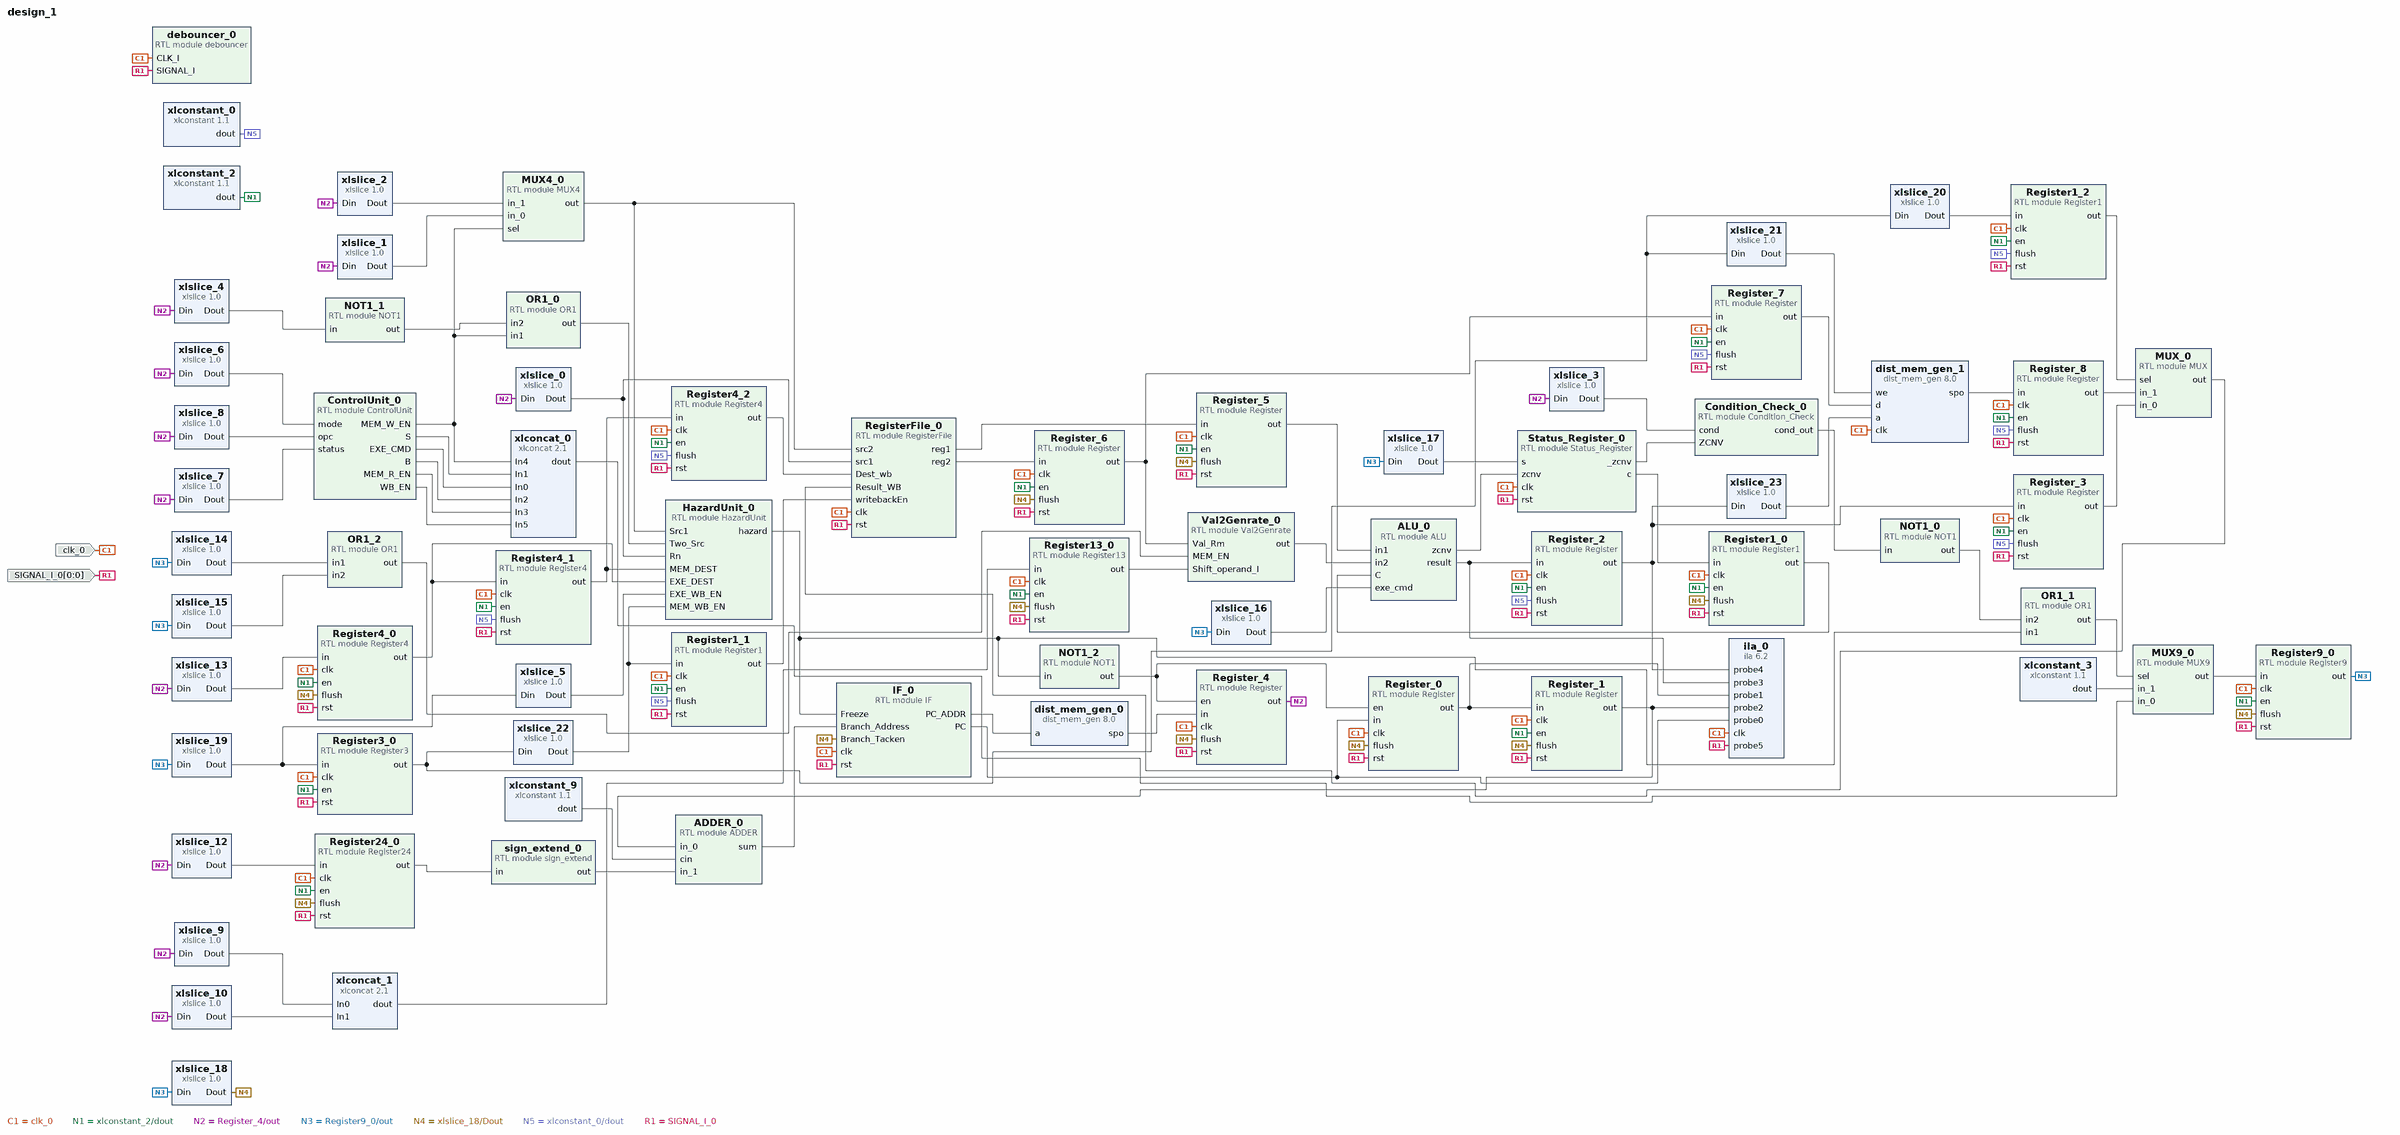
[diagram p0: block diagram of the top level]
# Vivado block design design_1, xc7z010clg400-1, Vivado 2018.3
create_bd_design design_1

create_bd_port -dir I -type clk clk_0
create_bd_port -dir I -from 0 -to 0 SIGNAL_I_0

create_bd_cell -type ip -vlnv xilinx.com:ip:xlconstant:1.1 xlconstant_2
create_bd_cell -type ip -vlnv xilinx.com:ip:ila:6.2 ila_0
set_property -dict [list \
  CONFIG.C_ENABLE_ILA_AXI_MON false \
  CONFIG.C_MONITOR_TYPE Native \
  CONFIG.C_NUM_OF_PROBES 6 \
  CONFIG.C_PROBE0_TYPE 1 \
  CONFIG.C_PROBE0_WIDTH 32 \
  CONFIG.C_PROBE1_TYPE 1 \
  CONFIG.C_PROBE1_WIDTH 32 \
  CONFIG.C_PROBE2_TYPE 1 \
  CONFIG.C_PROBE2_WIDTH 32 \
  CONFIG.C_PROBE3_TYPE 1 \
  CONFIG.C_PROBE3_WIDTH 32 \
  CONFIG.C_PROBE4_TYPE 1 \
  CONFIG.C_PROBE4_WIDTH 32 \
  CONFIG.C_PROBE5_TYPE 2 \
  CONFIG.C_PROBE6_TYPE 1 \
  CONFIG.C_PROBE6_WIDTH 1 \
] [get_bd_cells ila_0]
create_bd_cell -type module -reference ControlUnit ControlUnit_0
create_bd_cell -type module -reference RegisterFile RegisterFile_0
create_bd_cell -type ip -vlnv xilinx.com:ip:xlslice:1.0 xlslice_0
set_property -dict {CONFIG.DIN_FROM 19 CONFIG.DIN_TO 16 CONFIG.DOUT_WIDTH 4} [get_bd_cells xlslice_0]
create_bd_cell -type ip -vlnv xilinx.com:ip:xlslice:1.0 xlslice_1
set_property -dict {CONFIG.DIN_FROM 3 CONFIG.DIN_TO 0 CONFIG.DOUT_WIDTH 4} [get_bd_cells xlslice_1]
create_bd_cell -type ip -vlnv xilinx.com:ip:xlslice:1.0 xlslice_2
set_property -dict {CONFIG.DIN_FROM 15 CONFIG.DIN_TO 12 CONFIG.DOUT_WIDTH 4} [get_bd_cells xlslice_2]
create_bd_cell -type module -reference MUX4 MUX4_0
create_bd_cell -type module -reference OR1 OR1_0
create_bd_cell -type ip -vlnv xilinx.com:ip:xlslice:1.0 xlslice_3
set_property -dict {CONFIG.DIN_FROM 31 CONFIG.DIN_TO 28 CONFIG.DOUT_WIDTH 4} [get_bd_cells xlslice_3]
create_bd_cell -type ip -vlnv xilinx.com:ip:xlslice:1.0 xlslice_4
set_property -dict {CONFIG.DIN_FROM 25 CONFIG.DIN_TO 25 CONFIG.DOUT_WIDTH 1} [get_bd_cells xlslice_4]
create_bd_cell -type module -reference MUX9 MUX9_0
create_bd_cell -type ip -vlnv xilinx.com:ip:xlconcat:2.1 xlconcat_0
set_property -dict [list \
  CONFIG.IN0_WIDTH 4 \
  CONFIG.IN1_WIDTH 1 \
  CONFIG.IN2_WIDTH 1 \
  CONFIG.IN3_WIDTH 1 \
  CONFIG.IN4_WIDTH 1 \
  CONFIG.IN5_WIDTH 1 \
  CONFIG.NUM_PORTS 6 \
] [get_bd_cells xlconcat_0]
create_bd_cell -type ip -vlnv xilinx.com:ip:xlconstant:1.1 xlconstant_3
set_property -dict {CONFIG.CONST_VAL 0 CONFIG.CONST_WIDTH 9} [get_bd_cells xlconstant_3]
create_bd_cell -type module -reference OR1 OR1_1
create_bd_cell -type module -reference NOT1 NOT1_0
create_bd_cell -type module -reference NOT1 NOT1_1
create_bd_cell -type ip -vlnv xilinx.com:ip:xlslice:1.0 xlslice_6
set_property -dict {CONFIG.DIN_FROM 27 CONFIG.DIN_TO 26 CONFIG.DOUT_WIDTH 2} [get_bd_cells xlslice_6]
create_bd_cell -type ip -vlnv xilinx.com:ip:xlslice:1.0 xlslice_7
set_property -dict {CONFIG.DIN_FROM 20 CONFIG.DIN_TO 20 CONFIG.DOUT_WIDTH 1} [get_bd_cells xlslice_7]
create_bd_cell -type ip -vlnv xilinx.com:ip:xlslice:1.0 xlslice_8
set_property -dict {CONFIG.DIN_FROM 24 CONFIG.DIN_TO 21 CONFIG.DOUT_WIDTH 4} [get_bd_cells xlslice_8]
create_bd_cell -type module -reference Condition_Check Condition_Check_0
create_bd_cell -type ip -vlnv xilinx.com:ip:dist_mem_gen:8.0 dist_mem_gen_0
set_property -dict [list \
  CONFIG.coefficient_file ../../../../../../../output_ultimate.coe \
  CONFIG.data_width 32 \
  CONFIG.depth 8192 \
  CONFIG.memory_type rom \
] [get_bd_cells dist_mem_gen_0]
create_bd_cell -type ip -vlnv xilinx.com:ip:xlconcat:2.1 xlconcat_1
set_property -dict {CONFIG.IN0_WIDTH 1 CONFIG.IN1_WIDTH 12} [get_bd_cells xlconcat_1]
create_bd_cell -type ip -vlnv xilinx.com:ip:xlslice:1.0 xlslice_9
set_property -dict {CONFIG.DIN_FROM 25 CONFIG.DIN_TO 25 CONFIG.DOUT_WIDTH 1} [get_bd_cells xlslice_9]
create_bd_cell -type ip -vlnv xilinx.com:ip:xlslice:1.0 xlslice_10
set_property -dict {CONFIG.DIN_FROM 11 CONFIG.DOUT_WIDTH 12} [get_bd_cells xlslice_10]
create_bd_cell -type ip -vlnv xilinx.com:ip:xlslice:1.0 xlslice_12
set_property -dict {CONFIG.DIN_FROM 23 CONFIG.DOUT_WIDTH 24} [get_bd_cells xlslice_12]
create_bd_cell -type ip -vlnv xilinx.com:ip:xlslice:1.0 xlslice_13
set_property -dict {CONFIG.DIN_FROM 15 CONFIG.DIN_TO 12 CONFIG.DOUT_WIDTH 4} [get_bd_cells xlslice_13]
create_bd_cell -type module -reference OR1 OR1_2
create_bd_cell -type ip -vlnv xilinx.com:ip:xlslice:1.0 xlslice_14
set_property -dict {CONFIG.DIN_FROM 6 CONFIG.DIN_TO 6 CONFIG.DIN_WIDTH 9 CONFIG.DOUT_WIDTH 1} [get_bd_cells xlslice_14]
create_bd_cell -type ip -vlnv xilinx.com:ip:xlslice:1.0 xlslice_15
set_property -dict {CONFIG.DIN_FROM 7 CONFIG.DIN_TO 7 CONFIG.DIN_WIDTH 9 CONFIG.DOUT_WIDTH 1} [get_bd_cells xlslice_15]
create_bd_cell -type module -reference Val2Genrate Val2Genrate_0
create_bd_cell -type ip -vlnv xilinx.com:ip:xlslice:1.0 xlslice_16
set_property -dict {CONFIG.DIN_FROM 3 CONFIG.DIN_TO 0 CONFIG.DIN_WIDTH 9 CONFIG.DOUT_WIDTH 4} [get_bd_cells xlslice_16]
create_bd_cell -type module -reference ADDER ADDER_0
create_bd_cell -type ip -vlnv xilinx.com:ip:xlconstant:1.1 xlconstant_9
set_property -dict {CONFIG.CONST_VAL 0} [get_bd_cells xlconstant_9]
create_bd_cell -type ip -vlnv xilinx.com:ip:xlslice:1.0 xlslice_17
set_property -dict {CONFIG.DIN_FROM 4 CONFIG.DIN_TO 4 CONFIG.DIN_WIDTH 9 CONFIG.DOUT_WIDTH 1} [get_bd_cells xlslice_17]
create_bd_cell -type module -reference Status_Register Status_Register_0
create_bd_cell -type ip -vlnv xilinx.com:ip:xlslice:1.0 xlslice_18
set_property -dict {CONFIG.DIN_FROM 5 CONFIG.DIN_TO 5 CONFIG.DIN_WIDTH 9 CONFIG.DOUT_WIDTH 1} [get_bd_cells xlslice_18]
create_bd_cell -type ip -vlnv xilinx.com:ip:xlslice:1.0 xlslice_19
set_property -dict {CONFIG.DIN_FROM 8 CONFIG.DIN_TO 6 CONFIG.DIN_WIDTH 9 CONFIG.DOUT_WIDTH 3} [get_bd_cells xlslice_19]
create_bd_cell -type module -reference Register Register_0
create_bd_cell -type module -reference Register Register_4
create_bd_cell -type module -reference Register13 Register13_0
create_bd_cell -type module -reference Register1 Register1_0
create_bd_cell -type module -reference Register24 Register24_0
create_bd_cell -type module -reference Register4 Register4_0
create_bd_cell -type module -reference Register9 Register9_0
create_bd_cell -type module -reference Register Register_1
create_bd_cell -type module -reference Register4 Register4_1
create_bd_cell -type module -reference Register Register_2
create_bd_cell -type ip -vlnv xilinx.com:ip:xlconstant:1.1 xlconstant_0
set_property -dict {CONFIG.CONST_VAL 0} [get_bd_cells xlconstant_0]
create_bd_cell -type module -reference Register3 Register3_0
create_bd_cell -type module -reference Register Register_5
create_bd_cell -type module -reference Register Register_6
create_bd_cell -type module -reference Register Register_7
create_bd_cell -type module -reference debouncer debouncer_0
create_bd_cell -type ip -vlnv xilinx.com:ip:dist_mem_gen:8.0 dist_mem_gen_1
set_property -dict {CONFIG.data_width 32 CONFIG.depth 1024} [get_bd_cells dist_mem_gen_1]
create_bd_cell -type ip -vlnv xilinx.com:ip:xlslice:1.0 xlslice_20
set_property -dict {CONFIG.DIN_FROM 0 CONFIG.DIN_TO 0 CONFIG.DIN_WIDTH 3} [get_bd_cells xlslice_20]
create_bd_cell -type ip -vlnv xilinx.com:ip:xlslice:1.0 xlslice_21
set_property -dict {CONFIG.DIN_FROM 1 CONFIG.DIN_TO 1 CONFIG.DIN_WIDTH 3 CONFIG.DOUT_WIDTH 1} [get_bd_cells xlslice_21]
create_bd_cell -type ip -vlnv xilinx.com:ip:xlslice:1.0 xlslice_22
set_property -dict {CONFIG.DIN_FROM 2 CONFIG.DIN_TO 2 CONFIG.DIN_WIDTH 3 CONFIG.DOUT_WIDTH 1} [get_bd_cells xlslice_22]
create_bd_cell -type module -reference Register1 Register1_2
create_bd_cell -type module -reference Register4 Register4_2
create_bd_cell -type module -reference Register Register_8
create_bd_cell -type module -reference Register1 Register1_1
create_bd_cell -type module -reference Register Register_3
create_bd_cell -type module -reference MUX MUX_0
create_bd_cell -type module -reference HazardUnit HazardUnit_0
create_bd_cell -type ip -vlnv xilinx.com:ip:xlslice:1.0 xlslice_23
set_property -dict {CONFIG.DIN_FROM 9 CONFIG.DOUT_WIDTH 10} [get_bd_cells xlslice_23]
create_bd_cell -type ip -vlnv xilinx.com:ip:xlslice:1.0 xlslice_5
set_property -dict {CONFIG.DIN_FROM 2 CONFIG.DIN_TO 2 CONFIG.DIN_WIDTH 3} [get_bd_cells xlslice_5]
create_bd_cell -type module -reference IF IF_0
create_bd_cell -type module -reference NOT1 NOT1_2
create_bd_cell -type module -reference ALU ALU_0
create_bd_cell -type module -reference sign_extend sign_extend_0

# ---- connections ----

connect_bd_net -net clk_0_1 [get_bd_ports clk_0] \
  [get_bd_pins ila_0/clk] [get_bd_pins RegisterFile_0/clk] [get_bd_pins Status_Register_0/clk] [get_bd_pins Register_0/clk] \
  [get_bd_pins Register_4/clk] [get_bd_pins Register13_0/clk] [get_bd_pins Register1_0/clk] [get_bd_pins Register24_0/clk] \
  [get_bd_pins Register4_0/clk] [get_bd_pins Register9_0/clk] [get_bd_pins Register_1/clk] [get_bd_pins Register4_1/clk] \
  [get_bd_pins Register_2/clk] [get_bd_pins Register3_0/clk] [get_bd_pins Register_5/clk] [get_bd_pins Register_6/clk] \
  [get_bd_pins Register_7/clk] [get_bd_pins Register4_2/clk] [get_bd_pins Register1_2/clk] [get_bd_pins Register_8/clk] \
  [get_bd_pins dist_mem_gen_1/clk] [get_bd_pins Register1_1/clk] [get_bd_pins Register_3/clk] [get_bd_pins debouncer_0/CLK_I] \
  [get_bd_pins IF_0/clk]
connect_bd_net [get_bd_pins IF_0/PC_ADDR] [get_bd_pins dist_mem_gen_0/a]
connect_bd_net [get_bd_pins IF_0/PC] [get_bd_pins ila_0/probe0] [get_bd_pins Register_0/in]
connect_bd_net [get_bd_pins Register_0/out] [get_bd_pins ila_0/probe1] [get_bd_pins Register_1/in]
connect_bd_net [get_bd_pins Register_1/out] [get_bd_pins ila_0/probe2] [get_bd_pins ADDER_0/in_0]
connect_bd_net [get_bd_pins xlconstant_2/dout] \
  [get_bd_pins Register13_0/en] [get_bd_pins Register1_0/en] [get_bd_pins Register24_0/en] [get_bd_pins Register4_0/en] \
  [get_bd_pins Register9_0/en] [get_bd_pins Register_1/en] [get_bd_pins Register4_1/en] [get_bd_pins Register_2/en] \
  [get_bd_pins Register3_0/en] [get_bd_pins Register_5/en] [get_bd_pins Register_6/en] [get_bd_pins Register_7/en] \
  [get_bd_pins Register1_2/en] [get_bd_pins Register4_2/en] [get_bd_pins Register_8/en] [get_bd_pins Register1_1/en] \
  [get_bd_pins Register_3/en]
connect_bd_net [get_bd_pins xlslice_2/Dout] [get_bd_pins MUX4_0/in_1]
connect_bd_net [get_bd_pins xlslice_1/Dout] [get_bd_pins MUX4_0/in_0]
connect_bd_net [get_bd_pins xlslice_0/Dout] [get_bd_pins RegisterFile_0/src1] [get_bd_pins HazardUnit_0/Rn]
connect_bd_net [get_bd_pins MUX4_0/out] [get_bd_pins RegisterFile_0/src2] [get_bd_pins HazardUnit_0/Src1]
connect_bd_net [get_bd_pins RegisterFile_0/reg1] [get_bd_pins Register_5/in]
connect_bd_net [get_bd_pins RegisterFile_0/reg2] [get_bd_pins Register_6/in]
connect_bd_net [get_bd_pins Register_4/out] \
  [get_bd_pins xlslice_0/Din] [get_bd_pins xlslice_1/Din] [get_bd_pins xlslice_2/Din] [get_bd_pins xlslice_4/Din] \
  [get_bd_pins xlslice_3/Din] [get_bd_pins xlslice_6/Din] [get_bd_pins xlslice_8/Din] [get_bd_pins xlslice_7/Din] \
  [get_bd_pins xlslice_9/Din] [get_bd_pins xlslice_10/Din] [get_bd_pins xlslice_12/Din] [get_bd_pins xlslice_13/Din]
connect_bd_net [get_bd_pins ControlUnit_0/S] [get_bd_pins xlconcat_0/In1]
connect_bd_net [get_bd_pins ControlUnit_0/EXE_CMD] [get_bd_pins xlconcat_0/In0]
connect_bd_net [get_bd_pins ControlUnit_0/B] [get_bd_pins xlconcat_0/In2]
connect_bd_net [get_bd_pins ControlUnit_0/MEM_R_EN] [get_bd_pins xlconcat_0/In3]
connect_bd_net [get_bd_pins ControlUnit_0/MEM_W_EN] [get_bd_pins xlconcat_0/In4] [get_bd_pins MUX4_0/sel] [get_bd_pins OR1_0/in1]
connect_bd_net [get_bd_pins ControlUnit_0/WB_EN] [get_bd_pins xlconcat_0/In5]
connect_bd_net [get_bd_pins xlconcat_0/dout] [get_bd_pins MUX9_0/in_0]
connect_bd_net [get_bd_pins xlconstant_3/dout] [get_bd_pins MUX9_0/in_1]
connect_bd_net [get_bd_pins OR1_1/out] [get_bd_pins MUX9_0/sel]
connect_bd_net [get_bd_pins NOT1_0/out] [get_bd_pins OR1_1/in2]
connect_bd_net [get_bd_pins MUX9_0/out] [get_bd_pins Register9_0/in]
connect_bd_net [get_bd_pins xlslice_4/Dout] [get_bd_pins NOT1_1/in]
connect_bd_net [get_bd_pins NOT1_1/out] [get_bd_pins OR1_0/in2]
connect_bd_net [get_bd_pins xlslice_6/Dout] [get_bd_pins ControlUnit_0/mode]
connect_bd_net [get_bd_pins xlslice_8/Dout] [get_bd_pins ControlUnit_0/opc]
connect_bd_net [get_bd_pins xlslice_7/Dout] [get_bd_pins ControlUnit_0/status]
connect_bd_net [get_bd_pins xlslice_3/Dout] [get_bd_pins Condition_Check_0/cond]
connect_bd_net [get_bd_pins Condition_Check_0/cond_out] [get_bd_pins NOT1_0/in]
connect_bd_net [get_bd_pins dist_mem_gen_0/spo] [get_bd_pins Register_4/in]
connect_bd_net [get_bd_pins xlconcat_1/dout] [get_bd_pins Register13_0/in]
connect_bd_net [get_bd_pins xlslice_9/Dout] [get_bd_pins xlconcat_1/In0]
connect_bd_net [get_bd_pins xlslice_10/Dout] [get_bd_pins xlconcat_1/In1]
connect_bd_net [get_bd_pins xlslice_12/Dout] [get_bd_pins Register24_0/in]
connect_bd_net [get_bd_pins xlslice_13/Dout] [get_bd_pins Register4_0/in]
connect_bd_net [get_bd_pins Register9_0/out] \
  [get_bd_pins xlslice_14/Din] [get_bd_pins xlslice_15/Din] [get_bd_pins xlslice_16/Din] [get_bd_pins xlslice_17/Din] \
  [get_bd_pins xlslice_18/Din] [get_bd_pins xlslice_19/Din]
connect_bd_net [get_bd_pins xlslice_14/Dout] [get_bd_pins OR1_2/in1]
connect_bd_net [get_bd_pins xlslice_15/Dout] [get_bd_pins OR1_2/in2]
connect_bd_net [get_bd_pins Register_6/out] [get_bd_pins Val2Genrate_0/Val_Rm] [get_bd_pins Register_7/in]
connect_bd_net [get_bd_pins Register13_0/out] [get_bd_pins Val2Genrate_0/Shift_operand_I]
connect_bd_net [get_bd_pins OR1_2/out] [get_bd_pins Val2Genrate_0/MEM_EN]
connect_bd_net [get_bd_pins Register24_0/out] [get_bd_pins sign_extend_0/in]
connect_bd_net [get_bd_pins sign_extend_0/out] [get_bd_pins ADDER_0/in_1]
connect_bd_net [get_bd_pins xlconstant_9/dout] [get_bd_pins ADDER_0/cin]
connect_bd_net [get_bd_pins Status_Register_0/_zcnv] [get_bd_pins Condition_Check_0/ZCNV]
connect_bd_net [get_bd_pins xlslice_17/Dout] [get_bd_pins Status_Register_0/s]
connect_bd_net [get_bd_pins ADDER_0/sum] [get_bd_pins IF_0/Branch_Address]
connect_bd_net [get_bd_pins xlslice_18/Dout] \
  [get_bd_pins Register_0/flush] [get_bd_pins Register_4/flush] [get_bd_pins Register9_0/flush] \
  [get_bd_pins Register_1/flush] [get_bd_pins Register13_0/flush] [get_bd_pins Register24_0/flush] \
  [get_bd_pins Register4_0/flush] [get_bd_pins Register1_0/flush] [get_bd_pins Register_5/flush] \
  [get_bd_pins Register_6/flush] [get_bd_pins IF_0/Branch_Tacken]
connect_bd_net [get_bd_pins Register_5/out] [get_bd_pins ALU_0/in1]
connect_bd_net [get_bd_pins Val2Genrate_0/out] [get_bd_pins ALU_0/in2]
connect_bd_net [get_bd_pins xlslice_16/Dout] [get_bd_pins ALU_0/exe_cmd]
connect_bd_net [get_bd_pins Status_Register_0/c] [get_bd_pins Register1_0/in]
connect_bd_net [get_bd_pins Register1_0/out] [get_bd_pins ALU_0/C]
connect_bd_net [get_bd_pins xlslice_19/Dout] [get_bd_pins Register3_0/in] [get_bd_pins xlslice_5/Din]
connect_bd_net [get_bd_pins Register4_0/out] [get_bd_pins Register4_1/in] [get_bd_pins HazardUnit_0/EXE_DEST]
connect_bd_net [get_bd_pins ALU_0/result] [get_bd_pins Register_2/in] [get_bd_pins ila_0/probe3]
connect_bd_net [get_bd_pins ALU_0/zcnv] [get_bd_pins Status_Register_0/zcnv]
connect_bd_net [get_bd_pins xlconstant_0/dout] \
  [get_bd_pins Register4_1/flush] [get_bd_pins Register_2/flush] [get_bd_pins Register_7/flush] \
  [get_bd_pins Register1_2/flush] [get_bd_pins Register4_2/flush] [get_bd_pins Register_8/flush] \
  [get_bd_pins Register1_1/flush] [get_bd_pins Register_3/flush]
connect_bd_net -net SIGNAL_I_0_1 [get_bd_ports SIGNAL_I_0] \
  [get_bd_pins ila_0/probe5] [get_bd_pins RegisterFile_0/rst] [get_bd_pins Status_Register_0/rst] \
  [get_bd_pins Register_0/rst] [get_bd_pins Register_4/rst] [get_bd_pins Register13_0/rst] [get_bd_pins Register1_0/rst] \
  [get_bd_pins Register24_0/rst] [get_bd_pins Register4_0/rst] [get_bd_pins Register9_0/rst] [get_bd_pins Register_1/rst] \
  [get_bd_pins Register4_1/rst] [get_bd_pins Register_2/rst] [get_bd_pins Register3_0/rst] [get_bd_pins Register_5/rst] \
  [get_bd_pins Register_6/rst] [get_bd_pins Register_7/rst] [get_bd_pins Register4_2/rst] [get_bd_pins Register1_2/rst] \
  [get_bd_pins Register_8/rst] [get_bd_pins Register1_1/rst] [get_bd_pins Register_3/rst] [get_bd_pins debouncer_0/SIGNAL_I] \
  [get_bd_pins IF_0/rst]
connect_bd_net [get_bd_pins Register_2/out] [get_bd_pins ila_0/probe4] [get_bd_pins Register_3/in] [get_bd_pins xlslice_23/Din]
connect_bd_net [get_bd_pins Register3_0/out] [get_bd_pins xlslice_20/Din] [get_bd_pins xlslice_21/Din] [get_bd_pins xlslice_22/Din]
connect_bd_net [get_bd_pins xlslice_22/Dout] [get_bd_pins Register1_1/in] [get_bd_pins HazardUnit_0/MEM_WB_EN]
connect_bd_net [get_bd_pins xlslice_20/Dout] [get_bd_pins Register1_2/in]
connect_bd_net [get_bd_pins Register4_1/out] [get_bd_pins Register4_2/in] [get_bd_pins HazardUnit_0/MEM_DEST]
connect_bd_net [get_bd_pins dist_mem_gen_1/spo] [get_bd_pins Register_8/in]
connect_bd_net [get_bd_pins Register_3/out] [get_bd_pins MUX_0/in_0]
connect_bd_net [get_bd_pins Register_8/out] [get_bd_pins MUX_0/in_1]
connect_bd_net [get_bd_pins Register1_2/out] [get_bd_pins MUX_0/sel]
connect_bd_net [get_bd_pins Register4_2/out] [get_bd_pins RegisterFile_0/Dest_wb]
connect_bd_net [get_bd_pins MUX_0/out] [get_bd_pins RegisterFile_0/Result_WB]
connect_bd_net [get_bd_pins Register1_1/out] [get_bd_pins RegisterFile_0/writebackEn]
connect_bd_net [get_bd_pins xlslice_23/Dout] [get_bd_pins dist_mem_gen_1/a]
connect_bd_net [get_bd_pins Register_7/out] [get_bd_pins dist_mem_gen_1/d]
connect_bd_net [get_bd_pins xlslice_21/Dout] [get_bd_pins dist_mem_gen_1/we]
connect_bd_net [get_bd_pins OR1_0/out] [get_bd_pins HazardUnit_0/Two_Src]
connect_bd_net [get_bd_pins xlslice_5/Dout] [get_bd_pins HazardUnit_0/EXE_WB_EN]
connect_bd_net [get_bd_pins HazardUnit_0/hazard] [get_bd_pins OR1_1/in1] [get_bd_pins IF_0/Freeze] [get_bd_pins NOT1_2/in]
connect_bd_net [get_bd_pins NOT1_2/out] [get_bd_pins Register_0/en] [get_bd_pins Register_4/en]

validate_bd_design
save_bd_design
